# Altium schematic sheet nusense-mup-sensor.schdoc: NUSense
size A4; Organization: Elby Designs; Address1: 9 Follan Close; Address2: Kariong; Address3: NSW 2250; Address4: Australia; Revision: 1; SheetNumber: 2; SheetTotal: 9; DrawnBy: MPU Sensor; Engineer: Laurie Biddulph; PageSetup: Record=PageOptions|CenterHorizontal=True|CenterVertical=True|PrintScale=1.38|XCorrection=1.00|YCorrection=1.00|PrintKind=1|BorderSize=5000000|LeftOffset=0|BottomOffset=0|Orientation=2|PaperLength=1000|PaperWidth=1000|Scale=100|PaperSource=7|PrintQuality=-4|MediaType=1|DitherType=10|PaperKind=A3|PrintScaleMode=1
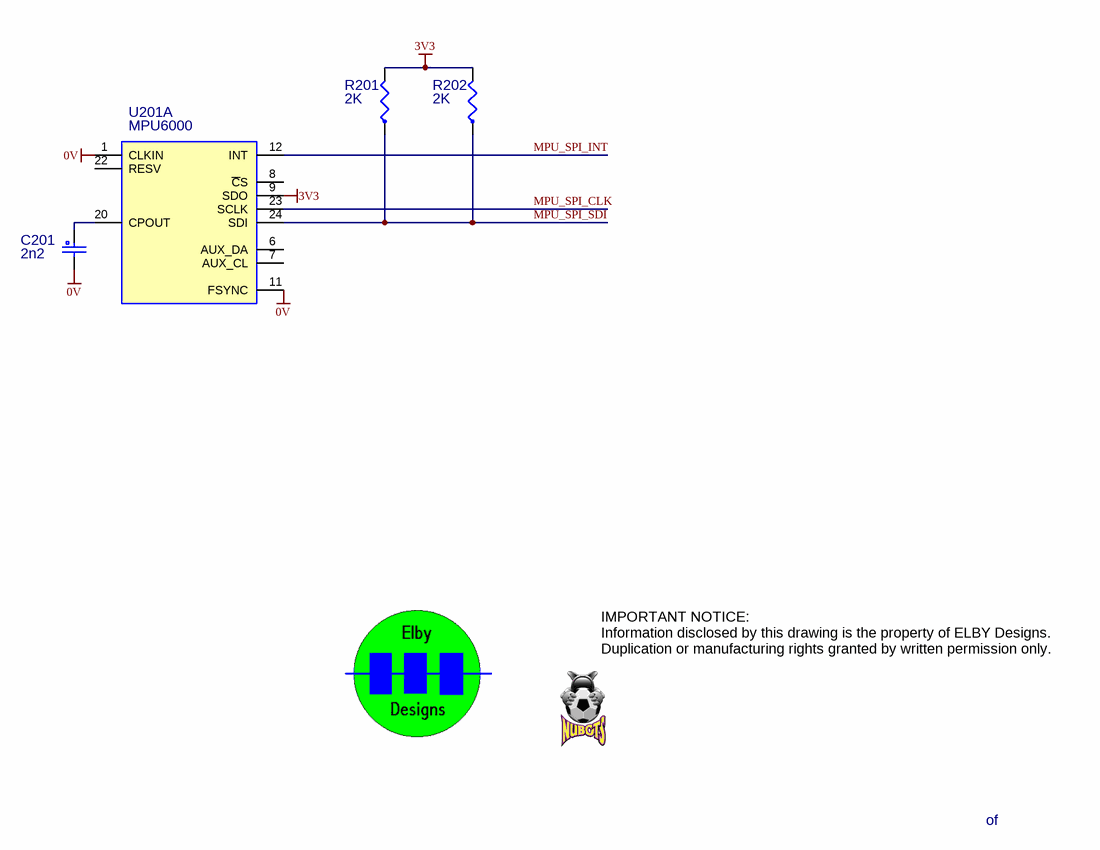
[diagram p0: nusense-mup-sensor.schdoc]

## Parts
C201  2n2  [RAD-0.2(LB)]
R201  2K  [AXIAL-0.4(LB)]
R202  2K  [AXIAL-0.4(LB)]
U201  MPU6000  (part A of 3)

## Nets
0V: C201.2 U201.1(CLKIN) U201.11(FSYNC)
3V3: R201.2 R202.2 U201.9(SDO)
MPU_SPI_CLK: U201.23(SCLK)
MPU_SPI_INT: U201.12(INT)
MPU_SPI_SDI: R201.1 R202.1 U201.24(SDI)
NetC201_1: C201.1 U201.20(CPOUT)

Not connected (* = marked no-connect by the designer): U201 6(AUX_DA) 7(AUX_CL) 8(~{C}S) 22(RESV)

## Notes on the sheet
- IMPORTANT NOTICE:
  Information disclosed by this drawing is the property of ELBY Designs.
  Duplication or manufacturing rights granted by written permission only.
- of

## Library data of the parts
C201 = CP-2N2F(LB): 63V 10% Metallised Polyester; EMRP: CP-2N2F
R201 R202 = RM-2K(LB): 0.5W 1% Metal Film Resistor; EMRP: RM-2K
U201 = MPU6000: Motion Tracking